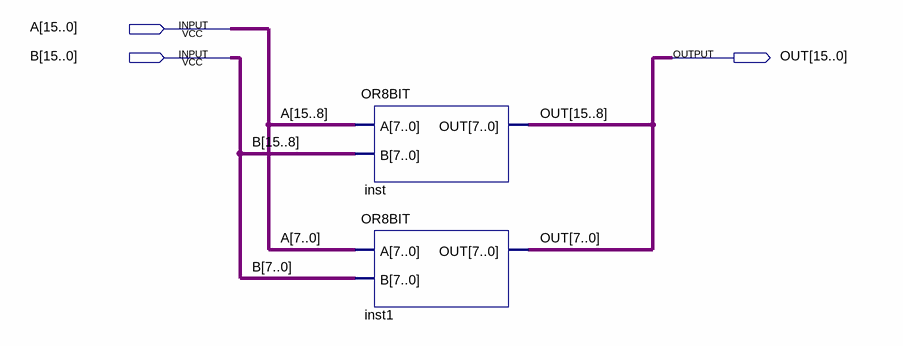
[diagram p0: schematic sheet]
// Quartus schematic OR16BIT.bdf as structural Verilog: 2 symbols, 3 pins
module OR16BIT (
  input  [15:0] A,
  input  [15:0] B,
  output [15:0] OUT
);

  OR8BIT inst (.A(A[15:8]), .B(B[15:8]), .OUT(OUT[15:8]));
  OR8BIT inst1 (.A(A[7:0]), .B(B[7:0]), .OUT(OUT[7:0]));
endmodule
